# EAGLE schematic AccBreakout (EAGLE 6.5.0)
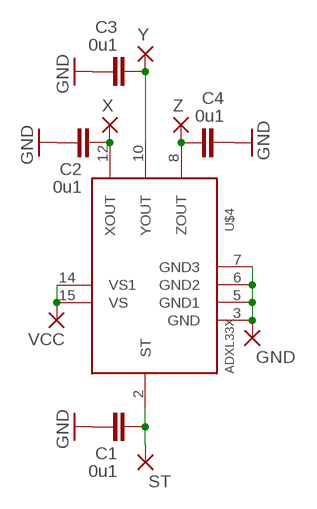
[diagram p0: schematic, sheet 1]

## Parts
C1  0u1  CAP0402-CAP  [0402-CAP]
C2  0u1  CAP0402-CAP  [0402-CAP]
C3  0u1  CAP0402-CAP  [0402-CAP]
C4  0u1  CAP0402-CAP  [0402-CAP]
GND  2,15/1,0  [2,15/1,0]
ST  2,15/1,0  [2,15/1,0]
U$4  ADXL33X  [16LCSP]
VCC  2,15/1,0  [2,15/1,0]
X  2,15/1,0  [2,15/1,0]
Y  2,15/1,0  [2,15/1,0]
Z  2,15/1,0  [2,15/1,0]

## Nets
GND: C1.1 C2.1 C3.1 C4.2 GND.1(P) U$4.3(GND) U$4.5(GND1) U$4.6(GND2) U$4.7(GND3)
N$1: C1.2 ST.1(P) U$4.2(ST)
N$2: C3.2 U$4.10(YOUT) Y.1(P)
N$3: C4.1 U$4.8(ZOUT) Z.1(P)
N$4: C2.2 U$4.12(XOUT) X.1(P)
VS: U$4.14(VS1) U$4.15(VS) VCC.1(P)

## Library data of the parts
C1-C4 = SparkFun-Capacitors:CAP: Capacitor Standard 0603 ceramic capacitor, and 0.1" leaded capacitor.
GND ST VCC X Y Z = wirepad:2,15/1,0: THROUGH-HOLE PAD
U$4 = adafruit:ADXL33X

## Net classes
0 default: width 0.152 mm, drill 0.305 mm, clearance 0.152 mm